# Altium schematic sheet Constant Current Controller.SchDoc
size B; SheetNumber: 6; SheetTotal: 7
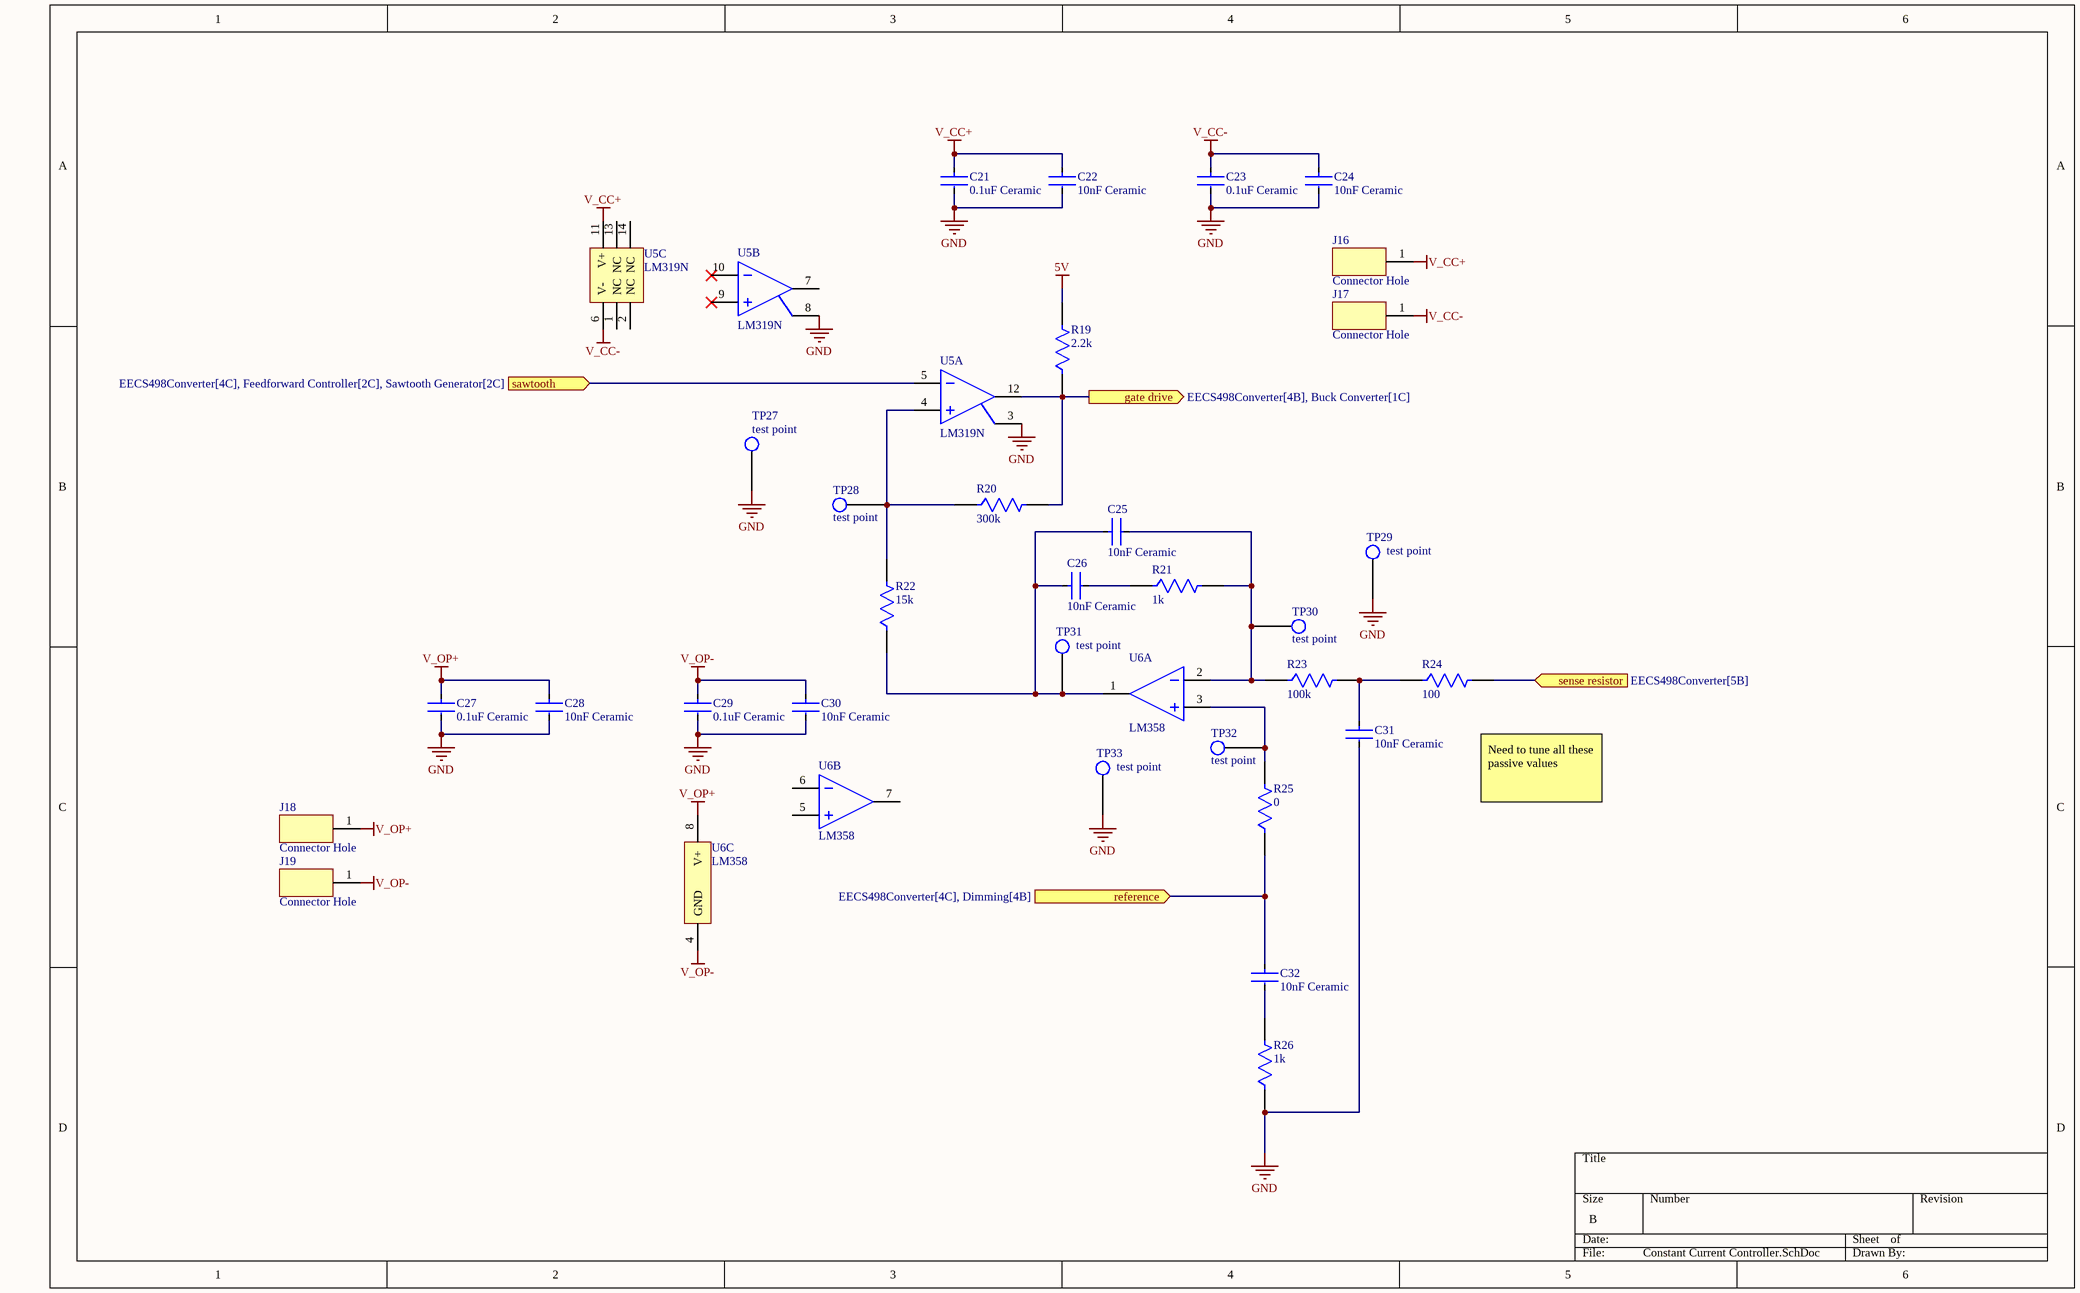
[diagram p0: Constant Current Controller.SchDoc]

## Parts
C21  0.1uF Ceramic  [FP-K15H5-MFG]
C22  10nF Ceramic  [FP-K15H5-MFG]
C23  0.1uF Ceramic  [FP-K15H5-MFG]
C24  10nF Ceramic  [FP-K15H5-MFG]
C25  10nF Ceramic  [FP-K15H5-MFG]
C26  10nF Ceramic  [FP-K15H5-MFG]
C27  0.1uF Ceramic  [FP-K15H5-MFG]
C28  10nF Ceramic  [FP-K15H5-MFG]
C29  0.1uF Ceramic  [FP-K15H5-MFG]
C30  10nF Ceramic  [FP-K15H5-MFG]
C31  10nF Ceramic  [FP-K15H5-MFG]
C32  10nF Ceramic  [FP-K15H5-MFG]
J16  Connector Hole  [Connector Hole]
J17  Connector Hole  [Connector Hole]
J18  Connector Hole  [Connector Hole]
J19  Connector Hole  [Connector Hole]
R19  2.2k  [FP-RLR07-MFG]
R20  300k  [FP-RLR07-MFG]
R21  1k  [FP-RLR07-MFG]
R22  15k  [FP-RLR07-MFG]
R23  100k  [FP-RLR07-MFG]
R24  100  [FP-RLR07-MFG]
R25  0  [FP-RLR07-MFG]
R26  1k  [FP-RLR07-MFG]
TP27  test point  [test point]
TP28  test point  [test point]
TP29  test point  [test point]
TP30  test point  [test point]
TP31  test point  [test point]
TP32  test point  [test point]
TP33  test point  [test point]
U5  LM319N  [LM319_DIP14]  (parts A,B,C of 3)
U6  LM358  [DIP8]  (parts A,B,C of 3)

## Ports
gate drive (out, see EECS498Converter[4B], Buck Converter[1C]), reference (in, see EECS498Converter[4C], Dimming[4B]), sawtooth (in, see EECS498Converter[4C], Feedforward Controller[2C], Sawtooth Generator[2C]), sense resistor (in, see EECS498Converter[5B])

## Nets
5V: R19.2
GND: C21.2 C22.2 C23.2 C24.2 C27.2 C28.2 C29.2 C30.2 C31.2 R26.1 TP27.1 TP29.1 TP33.1 U5.3(GND1) U5.8(GND2)
V_CC+: C21.1 C22.1 J16.1 U5.11(V+)
V_CC-: C23.1 C24.1 J17.1 U5.6(V-)
V_OP+: C27.1 C28.1 J18.1 U6.8(V+)
V_OP-: C29.1 C30.1 J19.1 U6.4(GND)
gate drive: R19.1 R20.2 U5.12(OUT1) ; port gate drive
reference: C32.1 R25.1 ; port reference
sawtooth: U5.5(IN1-) ; port sawtooth
sense resistor: R24.2 ; port sense resistor
NetC25_1: C25.1 C26.1 R22.1 TP31.1 U6.1(OUTA)
NetC25_2: C25.2 R21.2 R23.1 TP30.1 U6.2(INA-)
NetC26_2: C26.2 R21.1
NetC31_1: C31.1 R23.2 R24.1
NetC32_2: C32.2 R26.2
NetR20_1: R20.1 R22.2 TP28.1 U5.4(IN1+)
NetR25_2: R25.2 TP32.1 U6.3(INA+)

Not connected (* = marked no-connect by the designer): U5 1(NC) 2(NC) 7(OUT2) 9(IN2+)* 10(IN2-)* 13(NC) 14(NC); U6 5(INB+) 6(INB-) 7(OUTB)

## Notes on the sheet
- Need to tune all these passive values

## Library data of the parts
C21 C23 C27 C29 = 0.1uF Capacitor: CAP CER 0.1UF 50V X7R RADIAL; Capacitance: 100nF; Tolerance: 10%; Lead Length: 30mm; Lead Diameter: 0.5mm; Lead/Base Style: Formed Leads; Diameter: 500um; Max Operating Temperature: 125°C; Dielectric Material: Ceramic; Case/Package: Dipped; Dielectric: X7R; Lead Free: Lead Free; Construction: RADIAL; Voltage: 50V; Thickness: 2.6mm; Min Operating Temperature: -55°C; Lead Pitch: 5mm; Height: 4mm; Radiation Hardening: No; Voltage Rating: 50V; Depth: 2.5mm; Voltage Rating (DC): 50V; Package Quantity: 1; Weight: 0.005644oz; Series: K; Mount: Through Hole; Termination: Radial; Height - Seated (Max): 0.257inch; Length: 4mm; Packaging: Tape and Reel; Width: 2.5mm; RoHS Compliant: Yes
C22 C24-C26 C28 C30-C32 = 10nF Capacitor: CAP CER 10nF 50V X7R RADIAL; Capacitance: 100nF; Tolerance: 10%; Lead Length: 30mm; Lead Diameter: 0.5mm; Lead/Base Style: Formed Leads; Diameter: 500um; Max Operating Temperature: 125°C; Dielectric Material: Ceramic; Case/Package: Dipped; Dielectric: X7R; Lead Free: Lead Free; Construction: RADIAL; Voltage: 50V; Thickness: 2.6mm; Min Operating Temperature: -55°C; Lead Pitch: 5mm; Height: 4mm; Radiation Hardening: No; Voltage Rating: 50V; Depth: 2.5mm; Voltage Rating (DC): 50V; Package Quantity: 1; Weight: 0.005644oz; Series: K; Mount: Through Hole; Termination: Radial; Height - Seated (Max): 0.257inch; Length: 4mm; Packaging: Tape and Reel; Width: 2.5mm; RoHS Compliant: Yes
R19-R26 = Resistor: Resistor, ± 1%, 250 mW, Axial Leaded, Metal Film, Military Reliability; NexarPartId: 39453770; Max Power Dissipation: 250mW; Resistance: 100kΩ; Lead Length: 38.1mm; Voltage Rating: 250V; Lead Diameter: 640µm; Temperature Coefficient: 100ppm/°C; Wire/Cable Diameter: 50.8µm; Military Standard: MIL-PRF-39017; REACH SVHC: Unknown; Min Operating Temperature: -65°C; Length: 7.62mm; Case/Package: Axial; Lead Free: Contains Lead; Height: 2.5mm; Contact Plating: Lead, Tin; Radiation Hardening: No; Composition: Metal Film; Voltage Rating (DC): 250V; Schedule B: 8533210090, 8533210090|8533210090, 8533210090|8533210090|8533210090, 8533210090|8533210090|8533210090|8533210090; Diameter: 2.29mm; Tolerance: 1%; Max Operating Temperature: 150°C; Number of Terminations: 2; RoHS: Non-Compliant; Features: Military, Moisture Resistant, Weldable; Power Rating: 250mW; Packaging: Bulk; Width: 2.29mm; Termination: Axial; Failure Rate: 0.001%
U5 = LM319N: High Speed Dual Comparator, 14-pin MDIP; Manufacturer: Texas Instruments; PowerWise: N; PackageTopMarking: NSUZXYYTTE#*LM319N; CompType: Amplifiers; ComponentLink1Description: Datasheet URL; PinCount: 14; PackageDescription: MDIP, .750 x .250 x.130in, 14 Lead, .100in Pitch; ComponentLink1URL: http://www.ti.com/general/docs/lit/getliterature.tsp?genericPartNumber=LM319-N&fileType=pdf; Package Reference: NFF0014A; RoHS: N; Code_JEDEC: MS-001-AA
U6 = LM358: Low Power Dual Operational Amplifier, 8-pin MDIP, Pb-Free; Manufacturer: Texas Instruments; PowerWise: N; PackageTopMarking: NSUZXYTTE#*LM*358N; CompType: Amplifiers; Package Reference: P0008A; PinCount: 8; ComponentLink1URL: http://www.ti.com/general/docs/lit/getliterature.tsp?genericPartNumber=LM358-N&fileType=pdf; Code_JEDEC: MS-001-BA; PackageDescription: MDIP, .365 x .250 x .130in, 8 Lead, .100in Pitch; RoHS: Y; ComponentLink1Description: Datasheet URL